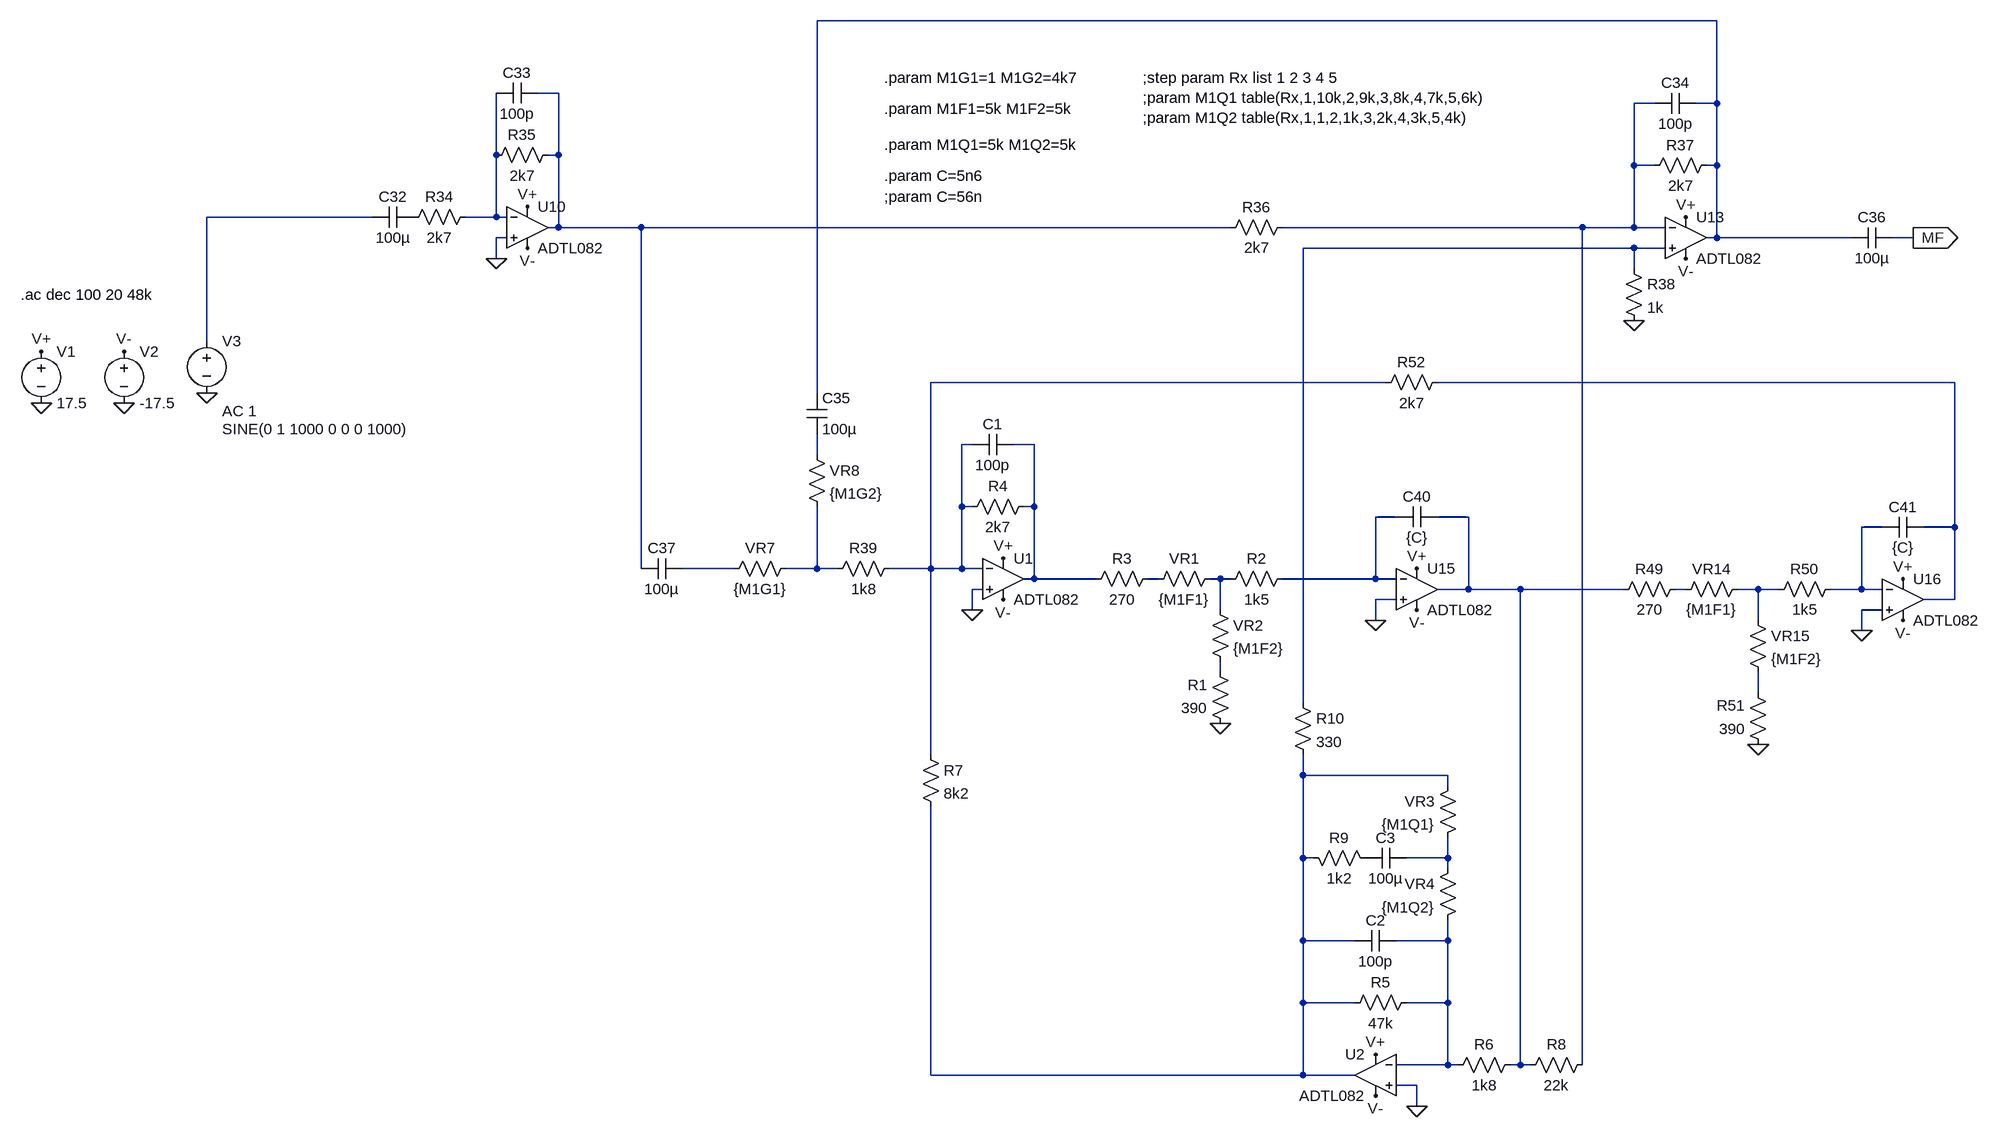
[diagram p0: schematic amek_mf2_rearranged.asc]
amek_mf2_rearranged.asc, the LTspice schematic file:
Version 4
SHEET 1 2500 4376
WIRE -1824 0 -3216 0
WIRE -3616 112 -3648 112
WIRE -1920 128 -1952 128
WIRE -1824 128 -1824 0
WIRE -1824 128 -1856 128
WIRE -3712 208 -3712 112
WIRE -3616 208 -3616 112
WIRE -3616 208 -3632 208
WIRE -1952 224 -1952 128
WIRE -1920 224 -1952 224
WIRE -1824 224 -1824 128
WIRE -1824 224 -1840 224
WIRE -3904 304 -4160 304
WIRE -3712 304 -3712 208
WIRE -3712 304 -3760 304
WIRE -3696 304 -3712 304
WIRE -3616 320 -3616 208
WIRE -3616 320 -3632 320
WIRE -3488 320 -3616 320
WIRE -2576 320 -3488 320
WIRE -2032 320 -2496 320
WIRE -1952 320 -1952 224
WIRE -1952 320 -2032 320
WIRE -1904 320 -1952 320
WIRE -3696 336 -3712 336
WIRE -1824 336 -1824 224
WIRE -1824 336 -1840 336
WIRE -1616 336 -1824 336
WIRE -1520 336 -1552 336
WIRE -1952 352 -2464 352
WIRE -1904 352 -1952 352
WIRE -3712 368 -3712 336
WIRE -1952 384 -1952 352
WIRE -4160 496 -4160 304
WIRE -2336 560 -3040 560
WIRE -1456 560 -2256 560
WIRE -3216 576 -3216 0
WIRE -2976 656 -2992 656
WIRE -2880 656 -2912 656
WIRE -3216 672 -3216 640
WIRE -2992 752 -2992 656
WIRE -2976 752 -2992 752
WIRE -2880 752 -2880 656
WIRE -2880 752 -2896 752
WIRE -2320 768 -2352 768
WIRE -2208 768 -2256 768
WIRE -1568 784 -1600 784
WIRE -1456 784 -1456 560
WIRE -1456 784 -1504 784
WIRE -3488 848 -3488 320
WIRE -3344 848 -3424 848
WIRE -3216 848 -3216 752
WIRE -3216 848 -3264 848
WIRE -3184 848 -3216 848
WIRE -3040 848 -3040 560
WIRE -3040 848 -3104 848
WIRE -2992 848 -2992 752
WIRE -2992 848 -3040 848
WIRE -2960 848 -2992 848
WIRE -2880 864 -2880 752
WIRE -2880 864 -2896 864
WIRE -2784 864 -2880 864
WIRE -2688 864 -2704 864
WIRE -2592 864 -2608 864
WIRE -2576 864 -2592 864
WIRE -2352 864 -2352 768
WIRE -2352 864 -2496 864
WIRE -2320 864 -2352 864
WIRE -2960 880 -2976 880
WIRE -2208 880 -2208 768
WIRE -2208 880 -2256 880
WIRE -2128 880 -2208 880
WIRE -1968 880 -2128 880
WIRE -1872 880 -1888 880
WIRE -1760 880 -1792 880
WIRE -1728 880 -1760 880
WIRE -1600 880 -1600 784
WIRE -1600 880 -1648 880
WIRE -1568 880 -1600 880
WIRE -2320 896 -2352 896
WIRE -1456 896 -1456 784
WIRE -1456 896 -1504 896
WIRE -2976 912 -2976 880
WIRE -2592 912 -2592 864
WIRE -1568 912 -1600 912
WIRE -2352 928 -2352 896
WIRE -1760 928 -1760 880
WIRE -1600 944 -1600 912
WIRE -2592 1008 -2592 992
WIRE -1760 1040 -1760 1008
WIRE -2464 1056 -2464 352
WIRE -3040 1136 -3040 848
WIRE -2464 1168 -2464 1136
WIRE -2240 1168 -2464 1168
WIRE -2240 1184 -2240 1168
WIRE -2464 1296 -2464 1168
WIRE -2448 1296 -2464 1296
WIRE -2240 1296 -2240 1264
WIRE -2240 1296 -2304 1296
WIRE -2240 1312 -2240 1296
WIRE -2464 1424 -2464 1296
WIRE -2384 1424 -2464 1424
WIRE -2240 1424 -2240 1392
WIRE -2240 1424 -2320 1424
WIRE -2464 1520 -2464 1424
WIRE -2384 1520 -2464 1520
WIRE -2240 1520 -2240 1424
WIRE -2240 1520 -2304 1520
WIRE -2240 1616 -2240 1520
WIRE -2240 1616 -2320 1616
WIRE -2224 1616 -2240 1616
WIRE -2128 1616 -2128 880
WIRE -2128 1616 -2144 1616
WIRE -2112 1616 -2128 1616
WIRE -2032 1616 -2032 320
WIRE -3040 1632 -3040 1216
WIRE -2464 1632 -2464 1520
WIRE -2464 1632 -3040 1632
WIRE -2384 1632 -2464 1632
WIRE -2288 1648 -2320 1648
WIRE -2288 1680 -2288 1648
FLAG -4416 592 0
FLAG -4416 512 V+
FLAG -4288 592 0
FLAG -4288 512 V-
FLAG -4160 576 0
FLAG -1520 336 MF
IOPIN -1520 336 Out
FLAG -3664 288 V+
FLAG -3664 352 V-
FLAG -3712 368 0
FLAG -1872 304 V+
FLAG -1872 368 V-
FLAG -1952 464 0
FLAG -2288 848 V+
FLAG -2288 912 V-
FLAG -1536 864 V+
FLAG -1536 928 V-
FLAG -1600 944 0
FLAG -2352 928 0
FLAG -1760 1120 0
FLAG -2928 832 V+
FLAG -2928 896 V-
FLAG -2976 912 0
FLAG -2592 1088 0
FLAG -2352 1600 V+
FLAG -2352 1664 V-
FLAG -2288 1680 0
SYMBOL voltage -4416 496 R0
WINDOW 123 0 0 Left 0
WINDOW 39 0 0 Left 0
SYMATTR InstName V1
SYMATTR Value 17.5
SYMBOL voltage -4288 496 R0
WINDOW 123 0 0 Left 0
WINDOW 39 0 0 Left 0
SYMATTR InstName V2
SYMATTR Value -17.5
SYMBOL voltage -4160 480 R0
WINDOW 3 24 152 Left 2
WINDOW 123 24 124 Left 2
WINDOW 39 0 0 Left 0
SYMATTR Value SINE(0 1 1000 0 0 0 1000)
SYMATTR Value2 AC 1
SYMATTR InstName V3
SYMBOL cap -3840 288 R90
WINDOW 0 0 32 VBottom 2
WINDOW 3 32 32 VTop 2
SYMATTR InstName C32
SYMATTR Value 100µ
SYMBOL res -3744 288 R90
WINDOW 0 0 56 VBottom 2
WINDOW 3 32 56 VTop 2
SYMATTR InstName R34
SYMATTR Value 2k7
SYMBOL Opamps\\ADTL082 -3664 256 R0
SYMATTR InstName U10
SYMBOL res -3616 192 R90
WINDOW 0 0 56 VBottom 2
WINDOW 3 32 56 VTop 2
SYMATTR InstName R35
SYMATTR Value 2k7
SYMBOL cap -3648 96 R90
WINDOW 0 0 32 VBottom 2
WINDOW 3 32 32 VTop 2
SYMATTR InstName C33
SYMATTR Value 100p
SYMBOL Opamps\\ADTL082 -1872 272 R0
SYMATTR InstName U13
SYMBOL res -1824 208 R90
WINDOW 0 0 56 VBottom 2
WINDOW 3 32 56 VTop 2
SYMATTR InstName R37
SYMATTR Value 2k7
SYMBOL cap -1856 112 R90
WINDOW 0 0 32 VBottom 2
WINDOW 3 32 32 VTop 2
SYMATTR InstName C34
SYMATTR Value 100p
SYMBOL cap -1552 320 R90
WINDOW 0 0 32 VBottom 2
WINDOW 3 32 32 VTop 2
SYMATTR InstName C36
SYMATTR Value 100µ
SYMBOL res -2480 304 R90
WINDOW 0 0 56 VBottom 2
WINDOW 3 32 56 VTop 2
SYMATTR InstName R36
SYMATTR Value 2k7
SYMBOL res -3248 832 R90
WINDOW 0 0 56 VBottom 2
WINDOW 3 32 56 VTop 2
SYMATTR InstName VR7
SYMATTR Value {M1G1}
SYMBOL res -3232 656 R0
SYMATTR InstName VR8
SYMATTR Value {M1G2}
SYMBOL cap -3424 832 R90
WINDOW 0 0 32 VBottom 2
WINDOW 3 32 32 VTop 2
SYMATTR InstName C37
SYMATTR Value 100µ
SYMBOL cap -3232 576 R0
SYMATTR InstName C35
SYMATTR Value 100µ
SYMBOL res -3088 832 R90
WINDOW 0 0 56 VBottom 2
WINDOW 3 32 56 VTop 2
SYMATTR InstName R39
SYMATTR Value 1k8
SYMBOL res -1968 368 R0
SYMATTR InstName R38
SYMATTR Value 1k
SYMBOL Opamps\\ADTL082 -2288 816 R0
SYMATTR InstName U15
SYMBOL cap -2256 752 R90
WINDOW 0 0 32 VBottom 2
WINDOW 3 32 32 VTop 2
SYMATTR InstName C40
SYMATTR Value {C}
SYMBOL res -1872 864 R90
WINDOW 0 0 56 VBottom 2
WINDOW 3 32 56 VTop 2
SYMATTR InstName R49
SYMATTR Value 270
SYMBOL res -1632 864 R90
WINDOW 0 0 56 VBottom 2
WINDOW 3 32 56 VTop 2
SYMATTR InstName R50
SYMATTR Value 1k5
SYMBOL res -1744 1136 R180
WINDOW 0 36 76 Left 2
WINDOW 3 36 40 Left 2
SYMATTR InstName R51
SYMATTR Value 390
SYMBOL Opamps\\ADTL082 -1536 832 R0
SYMATTR InstName U16
SYMBOL cap -1504 768 R90
WINDOW 0 0 32 VBottom 2
WINDOW 3 32 32 VTop 2
SYMATTR InstName C41
SYMATTR Value {C}
SYMBOL res -2240 544 R90
WINDOW 0 0 56 VBottom 2
WINDOW 3 32 56 VTop 2
SYMATTR InstName R52
SYMATTR Value 2k7
SYMBOL res -1776 864 R90
WINDOW 0 0 56 VBottom 2
WINDOW 3 32 56 VTop 2
SYMATTR InstName VR14
SYMATTR Value {M1F1}
SYMBOL res -1776 912 R0
SYMATTR InstName VR15
SYMATTR Value {M1F2}
SYMBOL res -2576 1104 R180
WINDOW 0 36 76 Left 2
WINDOW 3 36 40 Left 2
SYMATTR InstName R1
SYMATTR Value 390
SYMBOL res -2480 848 R90
WINDOW 0 0 56 VBottom 2
WINDOW 3 32 56 VTop 2
SYMATTR InstName R2
SYMATTR Value 1k5
SYMBOL res -2688 848 R90
WINDOW 0 0 56 VBottom 2
WINDOW 3 32 56 VTop 2
SYMATTR InstName R3
SYMATTR Value 270
SYMBOL res -2592 848 R90
WINDOW 0 0 56 VBottom 2
WINDOW 3 32 56 VTop 2
SYMATTR InstName VR1
SYMATTR Value {M1F1}
SYMBOL res -2608 896 R0
SYMATTR InstName VR2
SYMATTR Value {M1F2}
SYMBOL Opamps\\ADTL082 -2928 800 R0
SYMATTR InstName U1
SYMBOL res -2880 736 R90
WINDOW 0 0 56 VBottom 2
WINDOW 3 32 56 VTop 2
SYMATTR InstName R4
SYMATTR Value 2k7
SYMBOL cap -2912 640 R90
WINDOW 0 0 32 VBottom 2
WINDOW 3 32 32 VTop 2
SYMATTR InstName C1
SYMATTR Value 100p
SYMBOL Opamps\\ADTL082 -2352 1568 M0
SYMATTR InstName U2
SYMBOL res -2288 1504 R90
WINDOW 0 0 56 VBottom 2
WINDOW 3 32 56 VTop 2
SYMATTR InstName R5
SYMATTR Value 47k
SYMBOL cap -2320 1408 R90
WINDOW 0 0 32 VBottom 2
WINDOW 3 32 32 VTop 2
SYMATTR InstName C2
SYMATTR Value 100p
SYMBOL res -2128 1600 R90
WINDOW 0 0 56 VBottom 2
WINDOW 3 32 56 VTop 2
SYMATTR InstName R6
SYMATTR Value 1k8
SYMBOL res -3056 1120 R0
SYMATTR InstName R7
SYMATTR Value 8k2
SYMBOL res -2016 1600 R90
WINDOW 0 0 56 VBottom 2
WINDOW 3 32 56 VTop 2
SYMATTR InstName R8
SYMATTR Value 22k
SYMBOL res -2224 1168 M0
SYMATTR InstName VR3
SYMATTR Value {M1Q1}
SYMBOL res -2224 1296 M0
SYMATTR InstName VR4
SYMATTR Value {M1Q2}
SYMBOL cap -2368 1280 M90
WINDOW 0 0 32 VBottom 2
WINDOW 3 32 32 VTop 2
SYMATTR InstName C3
SYMATTR Value 100µ
SYMBOL res -2464 1280 M90
WINDOW 0 0 56 VBottom 2
WINDOW 3 32 56 VTop 2
SYMATTR InstName R9
SYMATTR Value 1k2
SYMBOL res -2480 1040 R0
SYMATTR InstName R10
SYMATTR Value 330
TEXT -4448 424 Left 2 !.ac dec 100 20 48k
TEXT -3112 88 Left 2 !.param M1G1=1 M1G2=4k7
TEXT -3112 136 Left 2 !.param M1F1=5k M1F2=5k
TEXT -3112 192 Left 2 !.param M1Q1=5k M1Q2=5k
TEXT -2712 88 Left 2 !;step param Rx list 1 2 3 4 5\n;param M1Q1 table(Rx,1,10k,2,9k,3,8k,4,7k,5,6k)\n;param M1Q2 table(Rx,1,1,2,1k,3,2k,4,3k,5,4k)
TEXT -3112 240 Left 2 !.param C=5n6
TEXT -3112 272 Left 2 !;param C=56n

The netlist it stands for:
* amek_mf2_rearranged.asc
V1 V+ 0 17.5
V2 V- 0 -17.5
V3 N005 0 SINE(0 1 1000 0 0 0 1000) AC 1
C32 P001 N005 100µ
R34 N004 P001 2k7
XU10 0 N004 V+ V- N002 ADTL082  ; pins In+ In- V+ V- OUT
R35 N002 N004 2k7
C33 N002 N004 100p
XU13 N006 N003 V+ V- N001 ADTL082  ; pins In+ In- V+ V- OUT
R37 N001 N003 2k7
C34 N001 N003 100p
C36 MF N001 100µ
R36 N003 N002 2k7
R§VR7 N015 N014 {M1G1}
R§VR8 N010 N015 {M1G2}
C37 N014 N002 100µ
C35 N001 N010 100µ
R39 N007 N015 1k8
R38 N006 0 1k
XU15 0 N011 V+ V- N012 ADTL082  ; pins In+ In- V+ V- OUT
C40 N012 N011 {C}
R49 N018 N012 270
R50 N013 N019 1k5
R51 0 N021 390
XU16 0 N013 V+ V- N008 ADTL082  ; pins In+ In- V+ V- OUT
C41 N008 N013 {C}
R52 N008 N007 2k7
R§VR14 N019 N018 {M1F1}
R§VR15 N019 N021 {M1F2}
R1 0 N020 390
R2 N011 N017 1k5
R3 N016 N009 270
R§VR1 N017 N016 {M1F1}
R§VR2 N017 N020 {M1F2}
XU1 0 N007 V+ V- N009 ADTL082  ; pins In+ In- V+ V- OUT
R4 N009 N007 2k7
C1 N009 N007 100p
XU2 0 N024 V+ V- N022 ADTL082  ; pins In+ In- V+ V- OUT
R5 N024 N022 47k
C2 N024 N022 100p
R6 N012 N024 1k8
R7 N007 N022 8k2
R8 N003 N012 22k
R§VR3 N022 N023 {M1Q1}
R§VR4 N023 N024 {M1Q2}
C3 P002 N023 100µ
R9 N022 P002 1k2
R10 N006 N022 330
.ac dec 100 20 48k
.param M1G1=1 M1G2=4k7
.param M1F1=5k M1F2=5k
.param M1Q1=5k M1Q2=5k
;step param Rx list 1 2 3 4 5
;param M1Q1 table(Rx,1,10k,2,9k,3,8k,4,7k,5,6k)
;param M1Q2 table(Rx,1,1,2,1k,3,2k,4,3k,5,4k)
.param C=5n6
;param C=56n
.lib ADI.lib
.backanno
.end